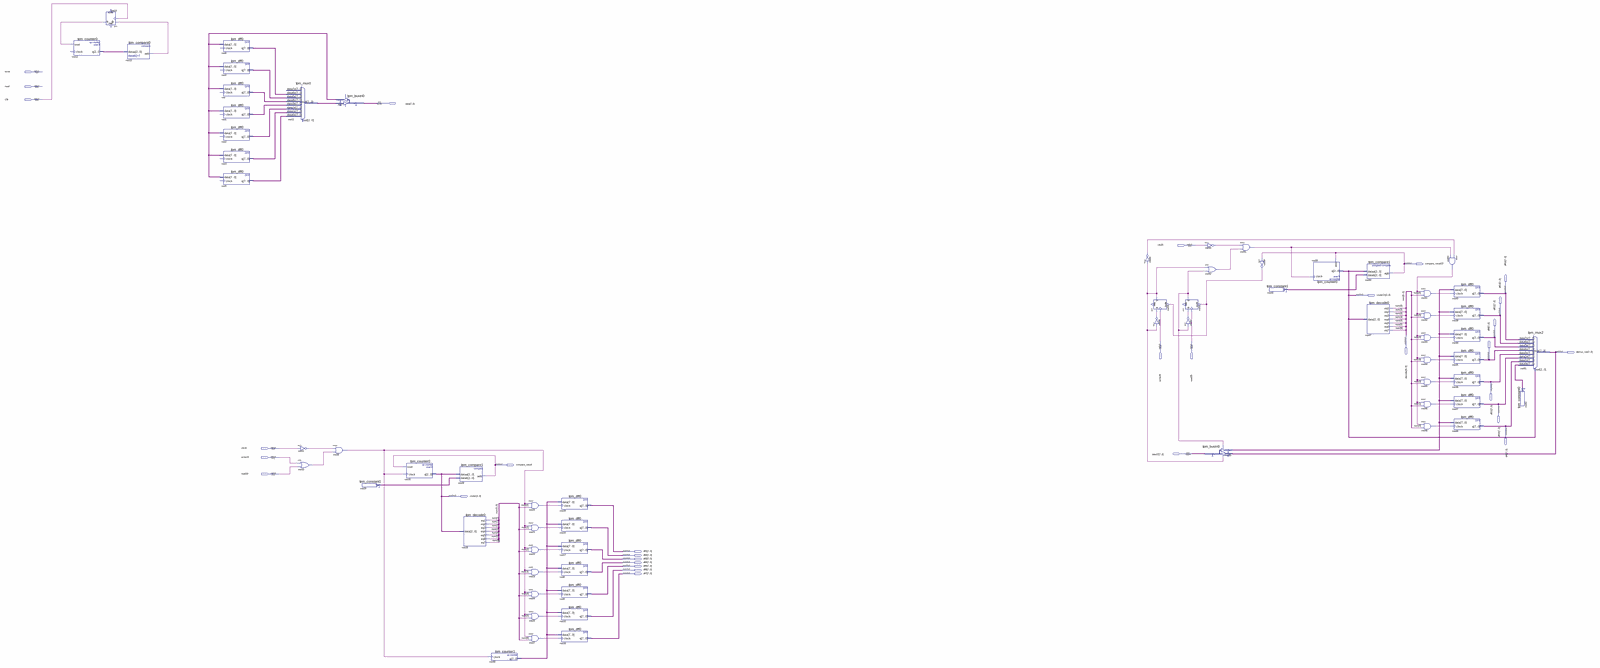
[diagram p0: schematic sheet, whole]
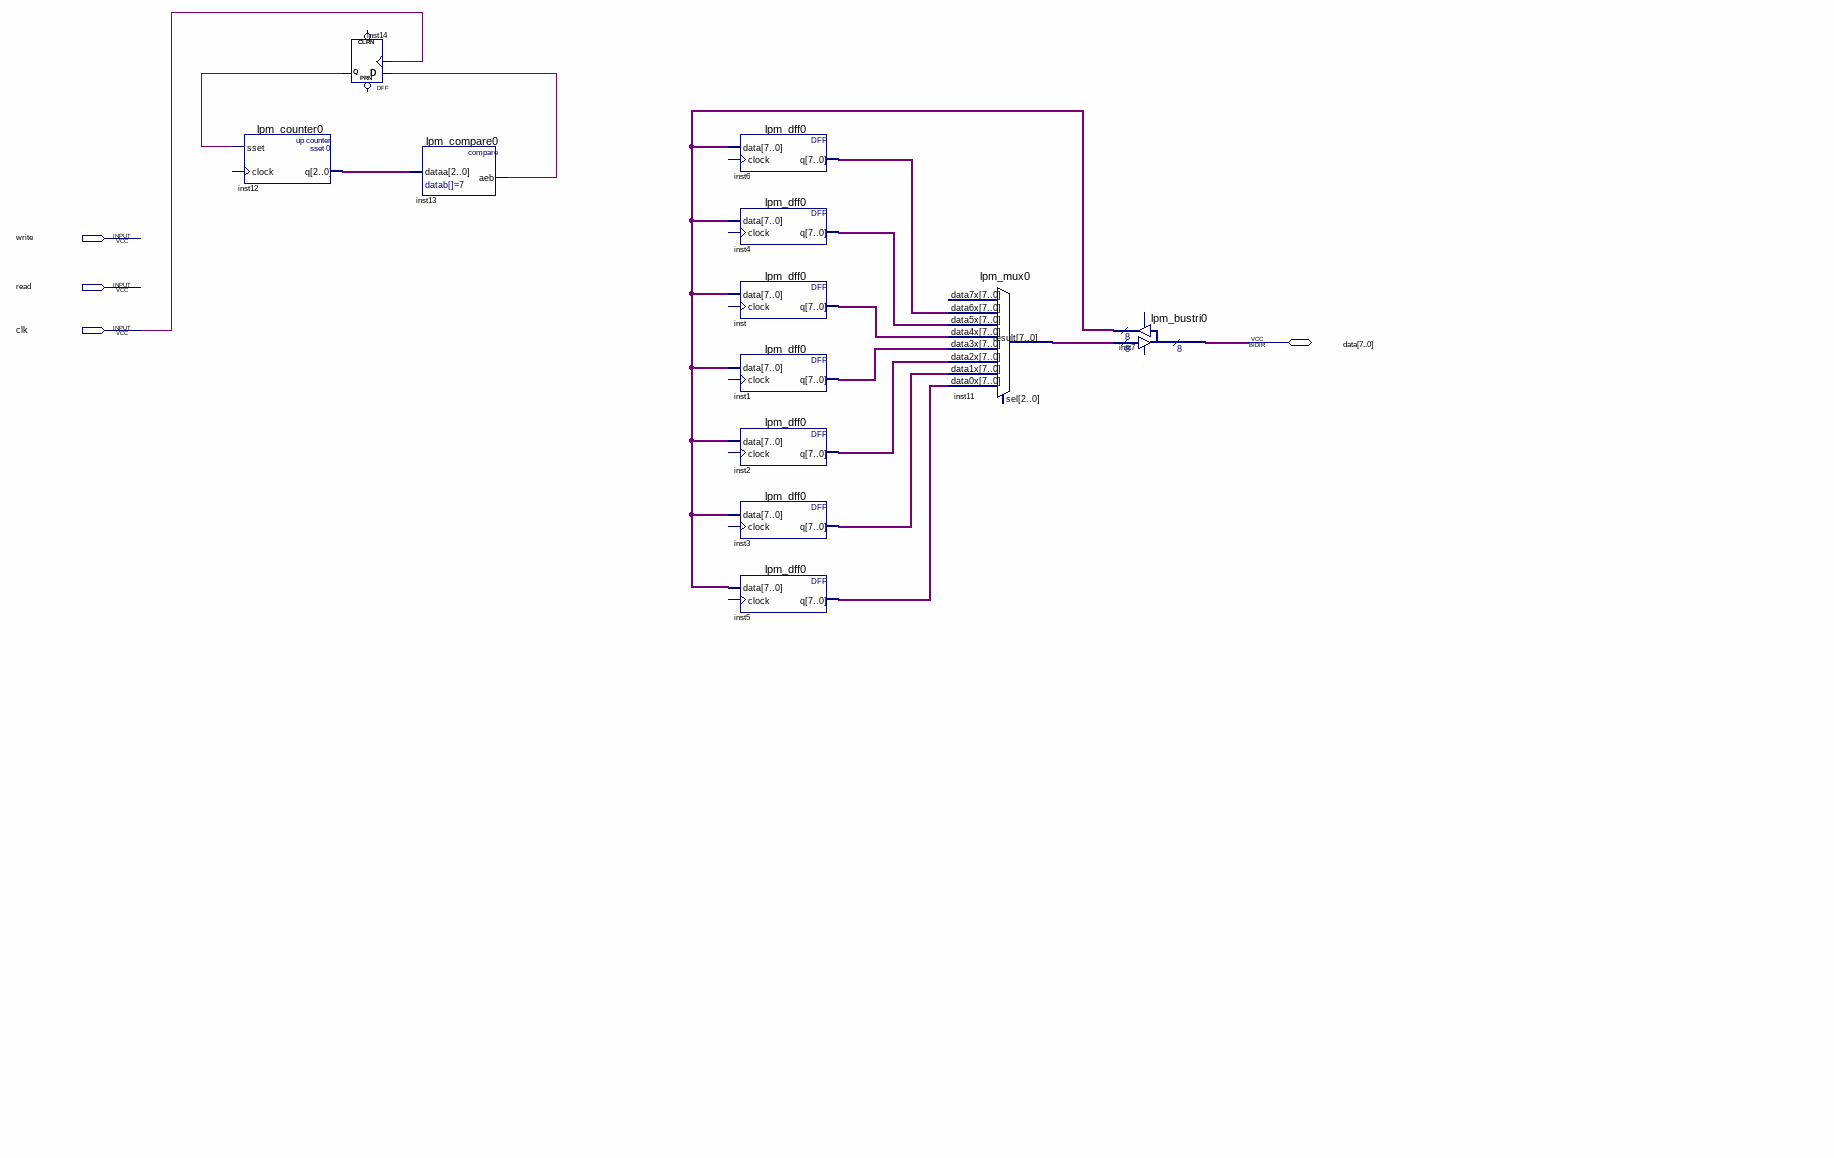
[diagram p1: schematic sheet, upper left part]
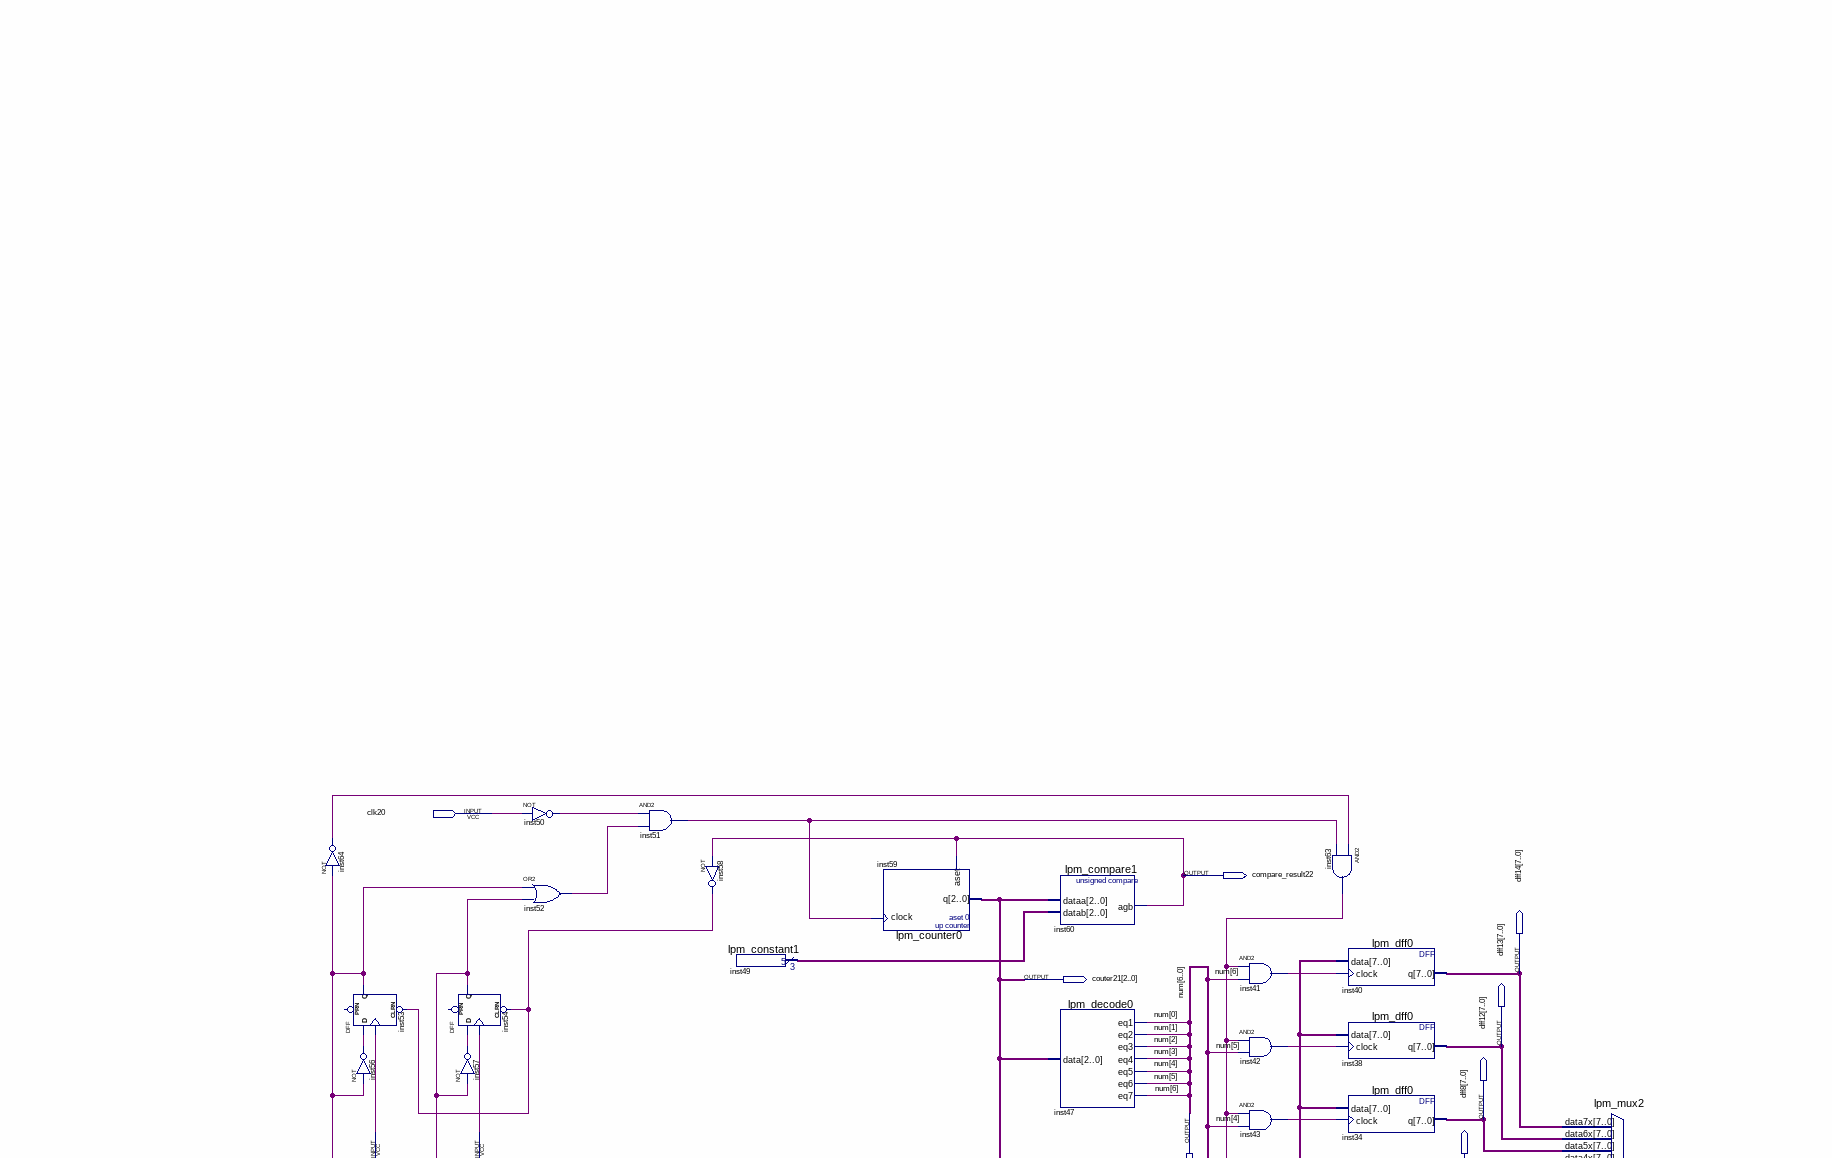
[diagram p2: schematic sheet, upper right part]
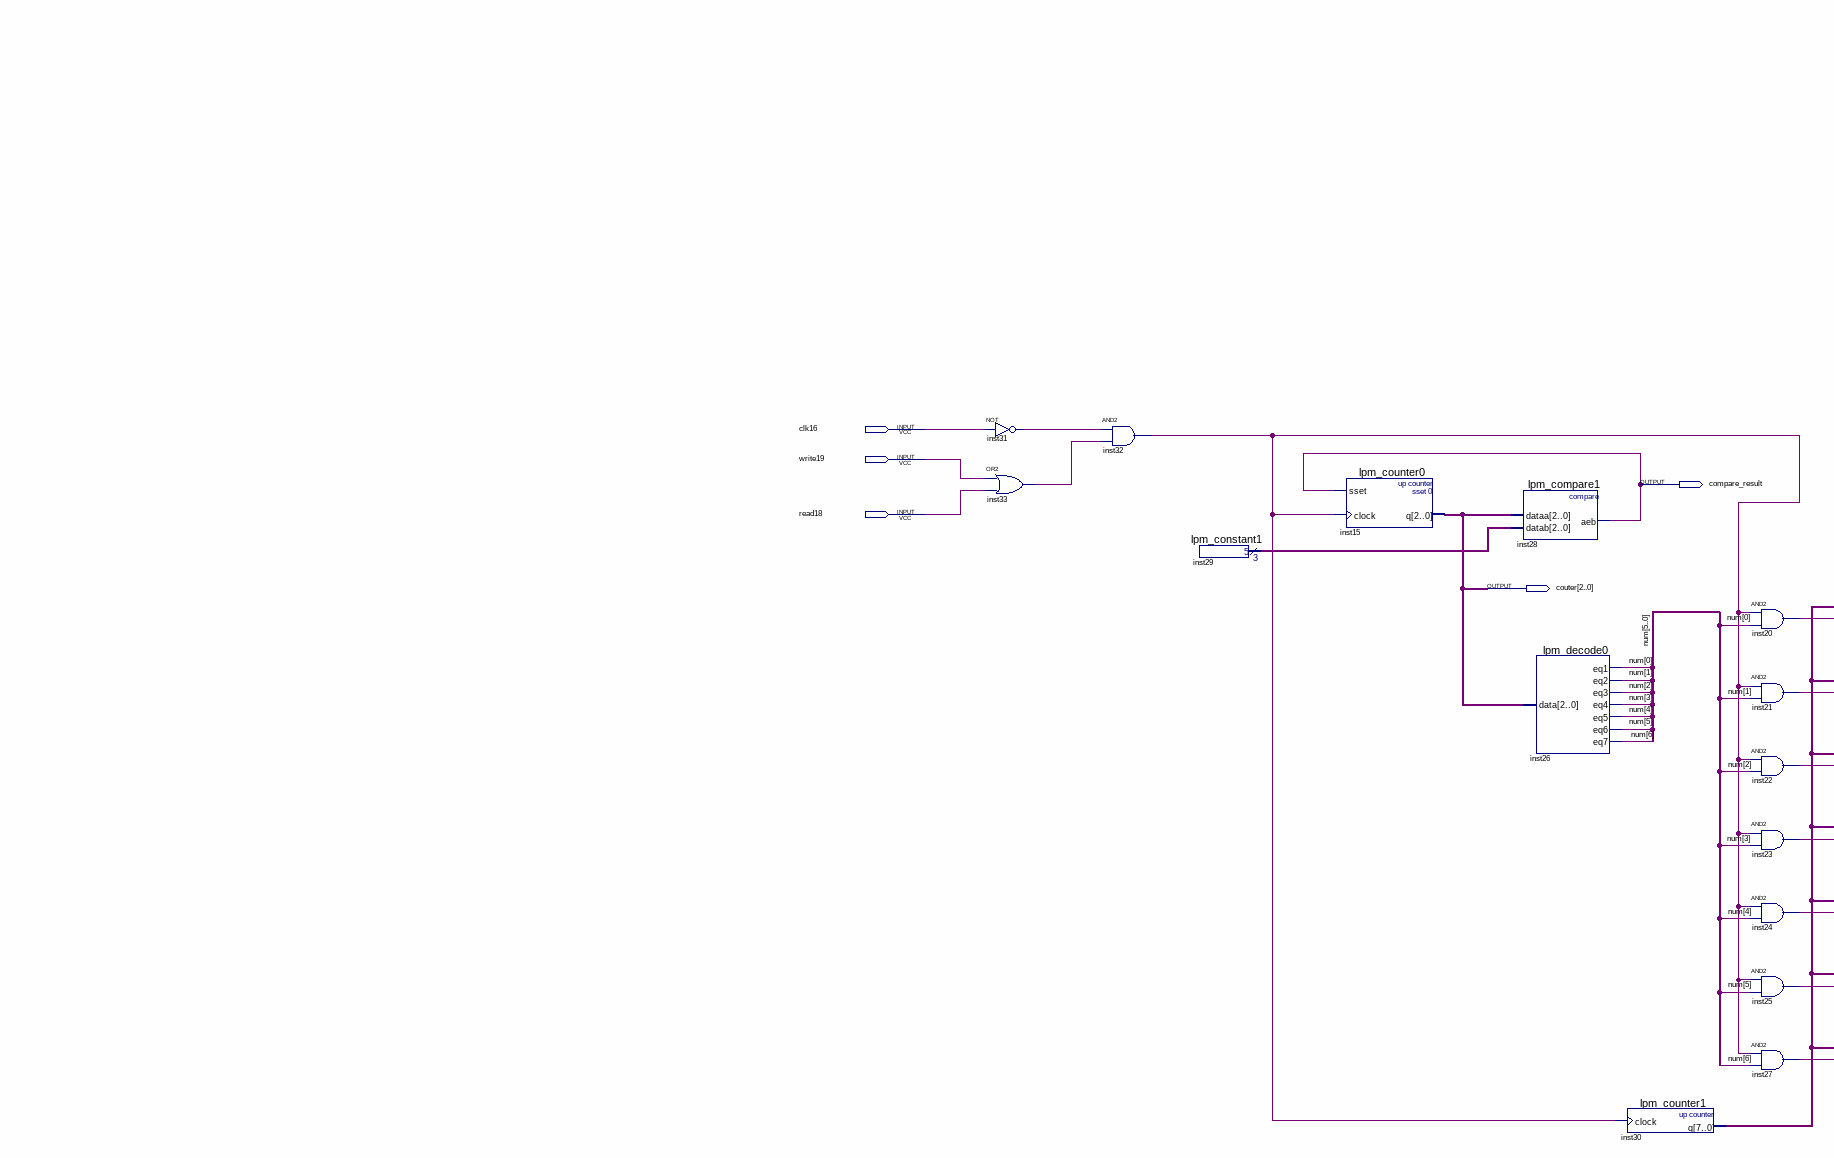
[diagram p3: schematic sheet, lower left part]
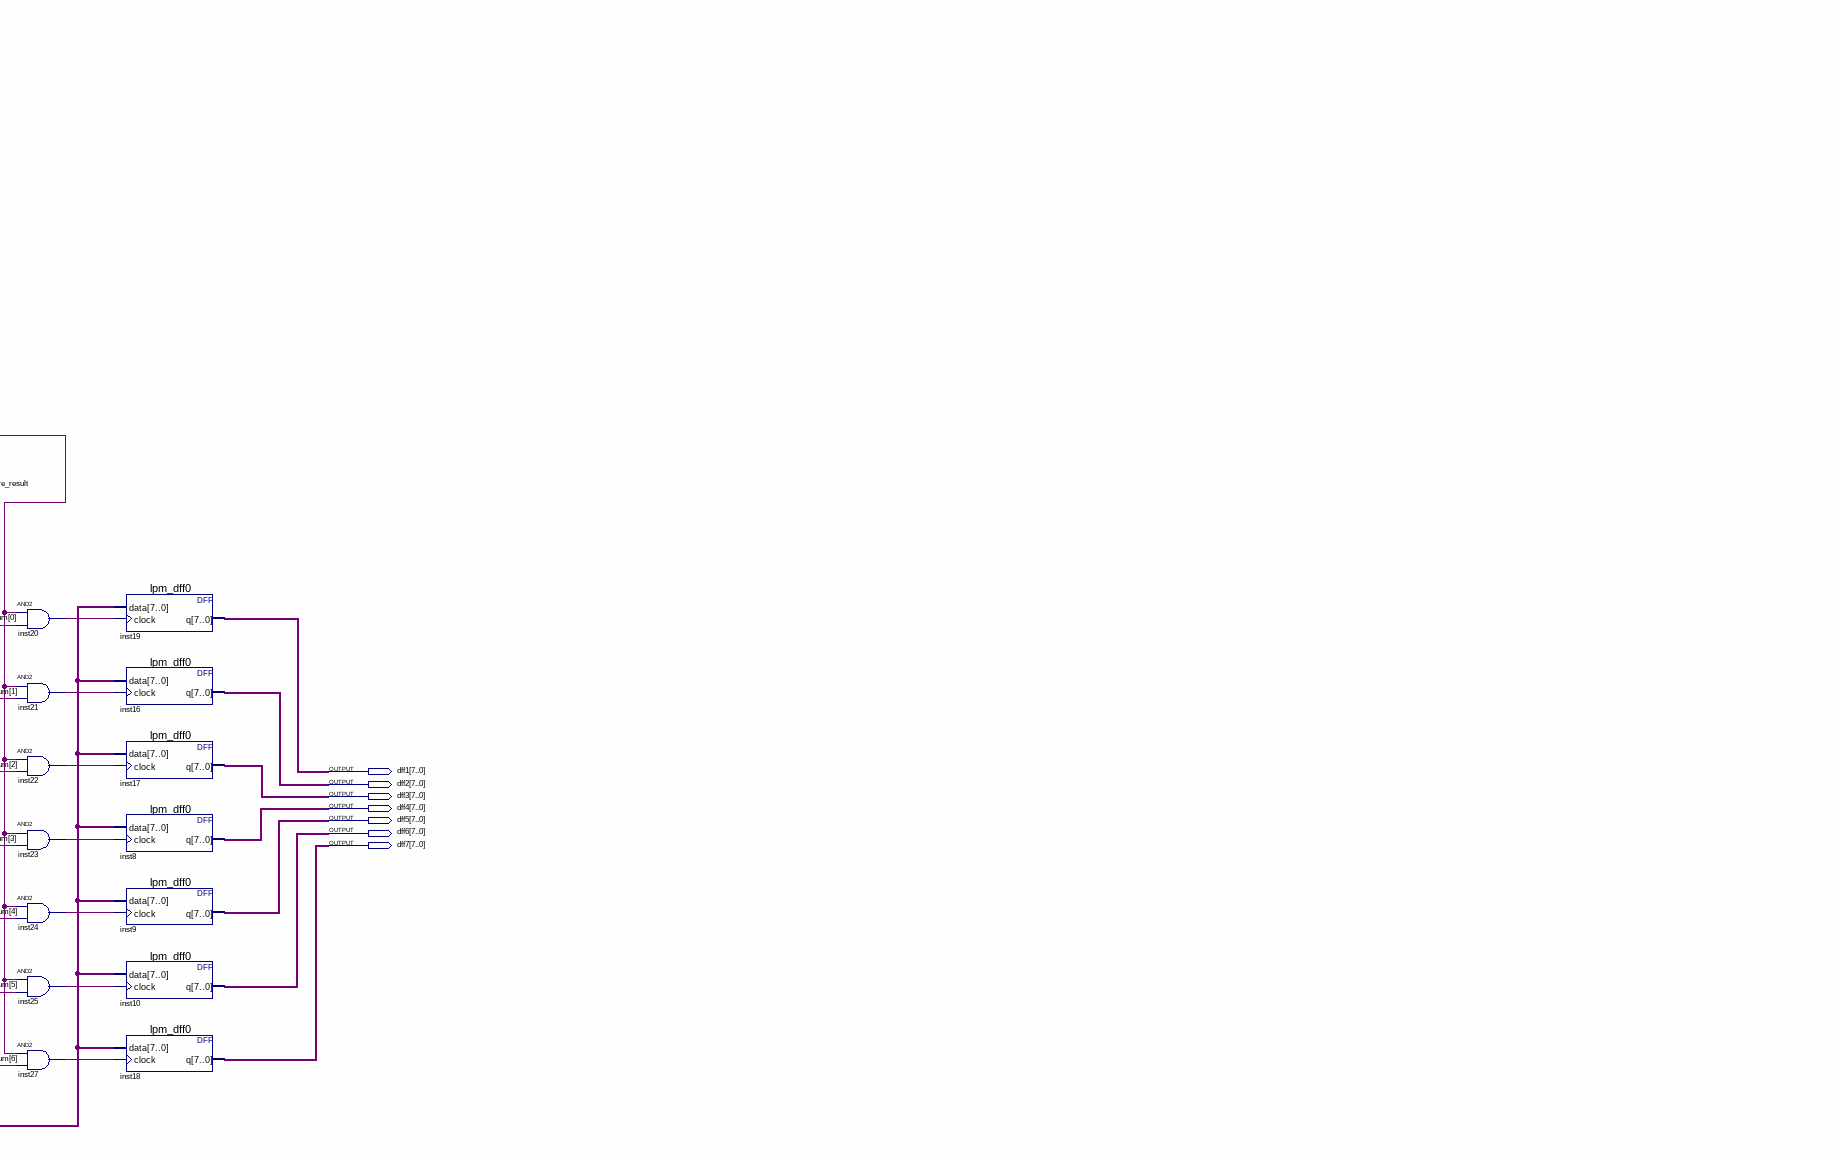
[diagram p4: schematic sheet, lower centre part]
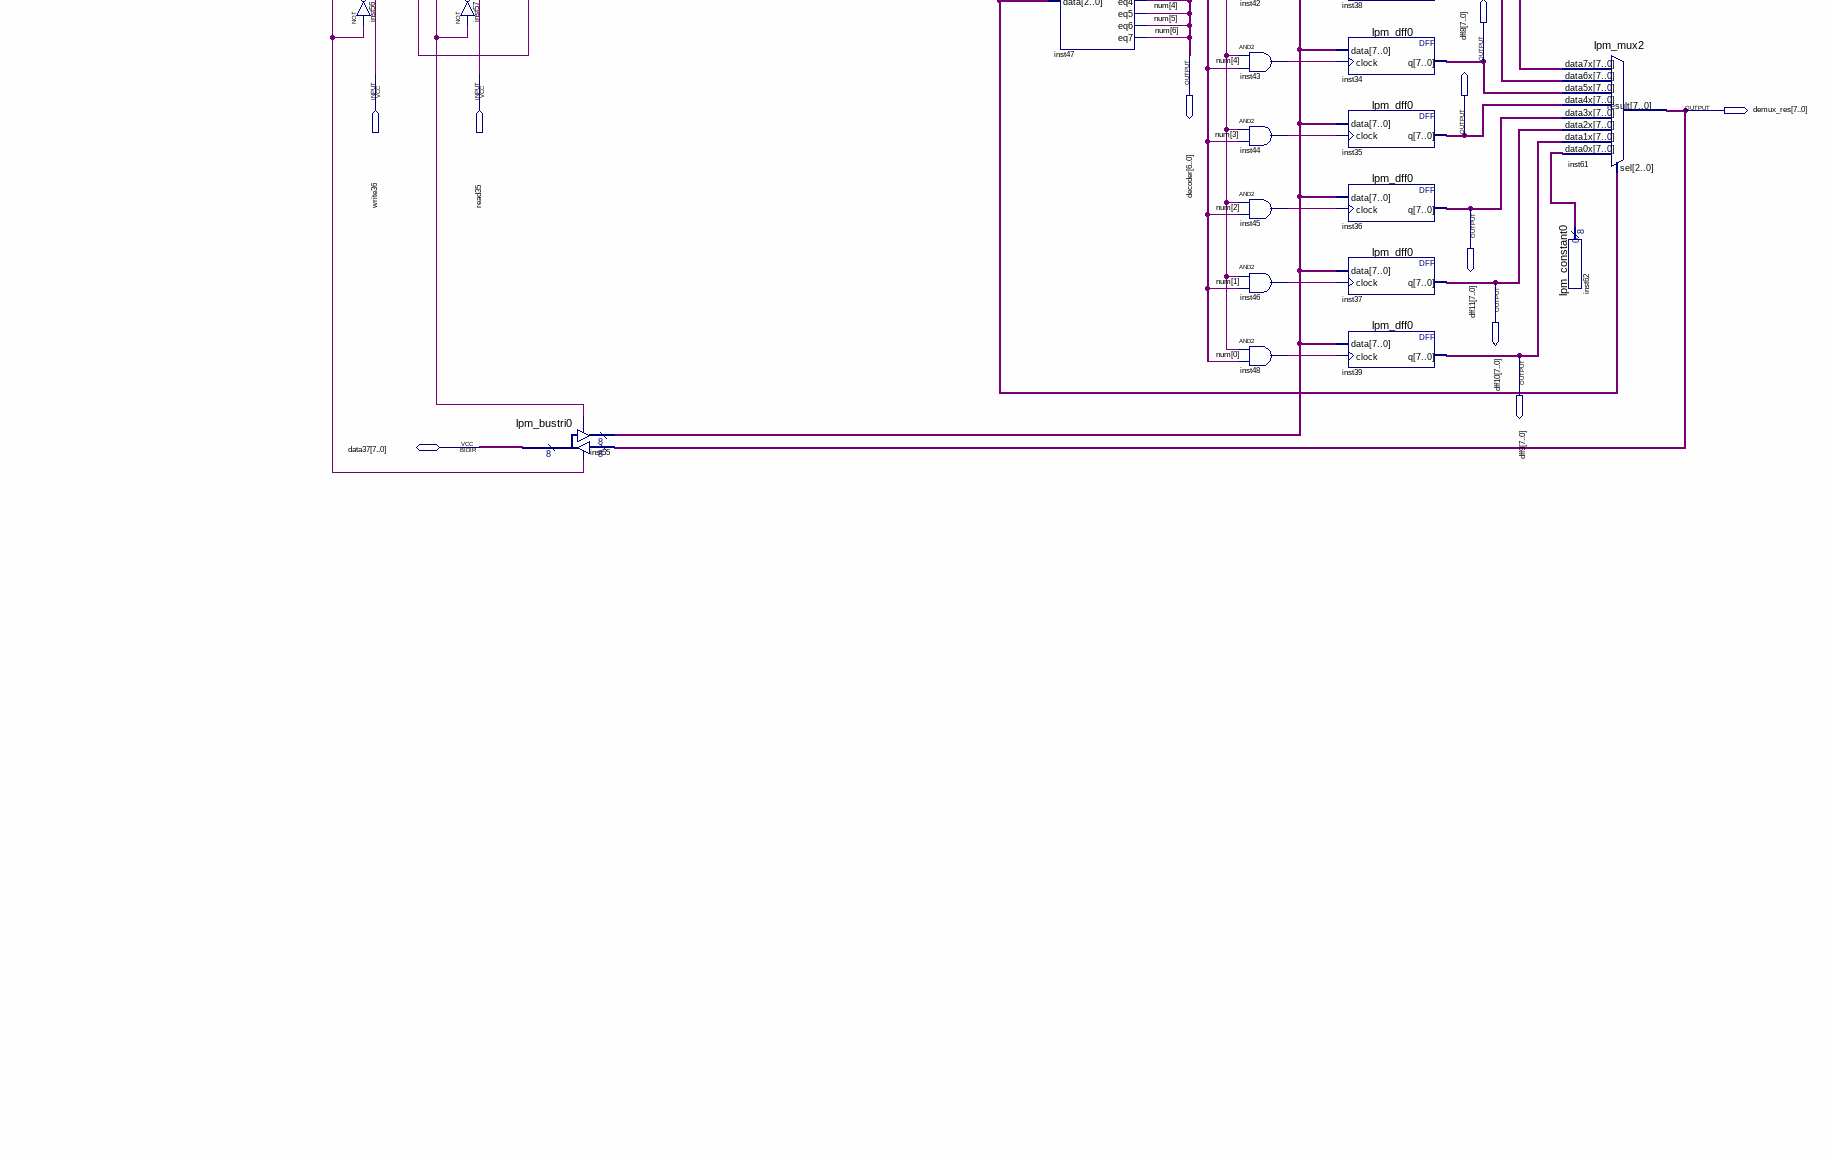
[diagram p5: schematic sheet, lower right part]
// Quartus schematic Buffer.bdf as structural Verilog: 65 symbols, 31 pins
module Buffer (
  input  write,
  input  read,
  input  clk,
  input  clk20,
  input  write36,
  input  read35,
  input  clk16,
  input  write19,
  input  read18,
  inout  [7:0] data,
  inout  [7:0] data37,
  output compare_result22,
  output [7:0] dff14,
  output [2:0] couter21,
  output [7:0] dff13,
  output [6:0] decoder,
  output [7:0] dff12,
  output [7:0] demux_res,
  output [7:0] dff8,
  output [7:0] dff11,
  output [7:0] dff10,
  output [7:0] dff9,
  output compare_result,
  output [2:0] couter,
  output [7:0] dff1,
  output [7:0] dff2,
  output [7:0] dff3,
  output [7:0] dff4,
  output [7:0] dff5,
  output [7:0] dff6,
  output [7:0] dff7
);

  wire inst13_aeb, inst14_q, inst20_out, inst21_out, inst22_out, inst23_out, inst24_out, inst25_out,
       inst27_out, inst31_out, inst32_out, inst33_out, inst41_out, inst42_out, inst43_out, inst44_out,
       inst45_out, inst46_out, inst48_out, inst50_out, inst51_out, inst52_out, inst53_q, inst54_q,
       inst56_out, inst57_out, inst58_out, inst63_out, inst64_out;
  wire [2:0] inst12_q, inst29_result, inst49_result;
  wire [7:0] inst1_q, inst2_q, inst3_q, inst4_q, inst5_q, inst6_q, inst7_result, inst11_result, inst30_q,
       inst55_result, inst62_result, inst_q;

  lpm_counter0 inst12 (.sset(inst14_q), .q(inst12_q));  // open: clock
  DFF inst14 (.CLK(clk), .D(inst13_aeb), .Q(inst14_q));  // open: CLRN, PRN
  lpm_compare0 inst13 (.dataa(inst12_q), .aeb(inst13_aeb));
  lpm_dff0 inst6 (.data(inst7_result), .q(inst6_q));  // open: clock
  lpm_dff0 inst4 (.data(inst7_result), .q(inst4_q));  // open: clock
  lpm_dff0 inst (.data(inst7_result), .q(inst_q));  // open: clock
  lpm_dff0 inst1 (.data(inst7_result), .q(inst1_q));  // open: clock
  lpm_dff0 inst2 (.data(inst7_result), .q(inst2_q));  // open: clock
  lpm_dff0 inst3 (.data(inst7_result), .q(inst3_q));  // open: clock
  lpm_dff0 inst5 (.data(inst7_result), .q(inst5_q));  // open: clock
  lpm_mux0 inst11 (
    .data6x(inst6_q), .data5x(inst4_q), .data4x(inst_q), .data3x(inst1_q), .data2x(inst2_q),
    .data1x(inst3_q), .data0x(inst5_q), .result(inst11_result));  // open: data7x, sel
  not inst31 (inst31_out, clk16);
  or inst33 (inst33_out, write19, read18);
  lpm_bustri0 inst7 (.data(inst11_result), .result(inst7_result), .tridata(data));  // open: enabledt, enabletr
  and inst32 (inst32_out, inst31_out, inst33_out);
  lpm_constant1 inst29 (.result(inst29_result));
  lpm_counter0 inst15 (.sset(compare_result), .clock(inst32_out), .q(couter));
  lpm_compare1 inst28 (.dataa(couter), .datab(inst29_result), .aeb(compare_result));
  lpm_decode0 inst26 (
    .data(couter), .eq1(decoder[0]), .eq2(decoder[1]), .eq3(decoder[2]), .eq4(decoder[3]), .eq5(decoder[4]),
    .eq6(decoder[5]), .eq7(decoder[6]));
  lpm_counter1 inst30 (.clock(inst32_out), .q(inst30_q));
  and inst20 (inst20_out, inst32_out, decoder[0]);
  and inst21 (inst21_out, inst32_out, decoder[1]);
  and inst22 (inst22_out, inst32_out, decoder[2]);
  and inst23 (inst23_out, inst32_out, decoder[3]);
  and inst24 (inst24_out, inst32_out, decoder[4]);
  and inst25 (inst25_out, inst32_out, decoder[5]);
  and inst27 (inst27_out, inst32_out, decoder[6]);
  lpm_dff0 inst19 (.data(inst30_q), .clock(inst20_out), .q(dff1));
  lpm_dff0 inst16 (.data(inst30_q), .clock(inst21_out), .q(dff2));
  lpm_dff0 inst17 (.data(inst30_q), .clock(inst22_out), .q(dff3));
  lpm_dff0 inst8 (.data(inst30_q), .clock(inst23_out), .q(dff4));
  lpm_dff0 inst9 (.data(inst30_q), .clock(inst24_out), .q(dff5));
  lpm_dff0 inst10 (.data(inst30_q), .clock(inst25_out), .q(dff6));
  lpm_dff0 inst18 (.data(inst30_q), .clock(inst27_out), .q(dff7));
  not inst64 (inst64_out, inst53_q);
  DFF inst53 (.CLRN(inst58_out), .CLK(write36), .D(inst56_out), .Q(inst53_q));  // open: PRN
  not inst56 (inst56_out, inst53_q);
  DFF inst54 (.CLRN(inst58_out), .CLK(read35), .D(inst57_out), .Q(inst54_q));  // open: PRN
  not inst57 (inst57_out, inst54_q);
  not inst50 (inst50_out, clk20);
  or inst52 (inst52_out, inst53_q, inst54_q);
  lpm_bustri0 inst55 (
    .enabledt(inst53_q), .data(demux_res), .enabletr(inst54_q), .result(inst55_result), .tridata(data37));
  and inst51 (inst51_out, inst50_out, inst52_out);
  not inst58 (inst58_out, compare_result22);
  lpm_constant1 inst49 (.result(inst49_result));
  lpm_counter0 inst59 (.clock(inst51_out), .aset(compare_result22), .q(couter21));
  lpm_compare1 inst60 (.dataa(couter21), .datab(inst49_result), .agb(compare_result22));
  lpm_decode0 inst47 (
    .data(couter21), .eq1(decoder[0]), .eq2(decoder[1]), .eq3(decoder[2]), .eq4(decoder[3]),
    .eq5(decoder[4]), .eq6(decoder[5]), .eq7(decoder[6]));
  and inst41 (inst41_out, inst63_out, decoder[6]);
  and inst42 (inst42_out, inst63_out, decoder[5]);
  and inst43 (inst43_out, inst63_out, decoder[4]);
  and inst44 (inst44_out, inst63_out, decoder[3]);
  and inst45 (inst45_out, inst63_out, decoder[2]);
  and inst46 (inst46_out, inst63_out, decoder[1]);
  and inst48 (inst48_out, inst63_out, decoder[0]);
  and inst63 (inst63_out, inst64_out, inst51_out);
  lpm_dff0 inst40 (.data(inst55_result), .clock(inst41_out), .q(dff14));
  lpm_dff0 inst38 (.data(inst55_result), .clock(inst42_out), .q(dff13));
  lpm_dff0 inst34 (.data(inst55_result), .clock(inst43_out), .q(dff12));
  lpm_dff0 inst35 (.data(inst55_result), .clock(inst44_out), .q(dff8));
  lpm_dff0 inst36 (.data(inst55_result), .clock(inst45_out), .q(dff11));
  lpm_dff0 inst37 (.data(inst55_result), .clock(inst46_out), .q(dff10));
  lpm_dff0 inst39 (.data(inst55_result), .clock(inst48_out), .q(dff9));
  lpm_mux2 inst61 (
    .data7x(dff14), .data6x(dff13), .data5x(dff12), .data4x(dff8), .data3x(dff11), .data2x(dff10),
    .data1x(dff9), .data0x(inst62_result), .sel(couter21), .result(demux_res));
  lpm_constant0 inst62 (.result(inst62_result));

  // Other names for the same wires on the sheet: num[6:0] = decoder
endmodule
